# EAGLE design RFID (EAGLE 6.2)
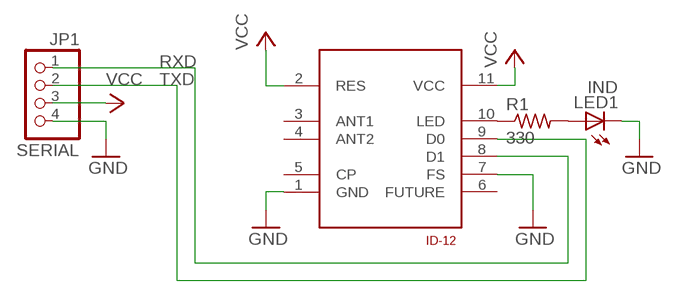
[diagram p0: schematic, sheet 1]

## Parts
JP1  SERIAL  PINHD-1X4  [1X04]
LED1  IND  LED3MM  [LED3MM]
R1  330  R-US_0207/10  [0207/10]
U$1  ID-20  [ID-20]

## Nets
GND: JP1.4 LED1.K(C) U$1.1(GND) U$1.7(FS)
N$1: R1.1 U$1.10(LED)
N$2: LED1.A R1.2
RXD: JP1.1 U$1.8(D1)
TXD: JP1.2 U$1.9(D0)
VCC: JP1.3 U$1.2(RES) U$1.11(VCC)
Unconnected: U$1.3(ANT1) U$1.4(ANT2) U$1.5(CP) U$1.6(FUTURE)

## Library data of the parts
JP1 = pinhead:PINHD-1X4: PIN HEADER
LED1 = led:LED: LED OSRAM: - CHIPLED LG R971, LG N971, LY N971, LG Q971, LY Q971, LO R971, LY R971 LH N974, LH R974 LS Q976, LO Q976, LY Q976 LO Q996 - Hyper CHIPLED LW Q18S LB Q993, LB Q99A, LB R99A - SideLED LS A670, LO A670, LY A670, LG A670, LP A670 LB A673, LV A673, LT A673, LW A673 LH A674 LY A675 LS A676, LA A676, LO A676, LY A676, LW A676 LS A679, LY A679, LG A679 - Hyper Micro SIDELED® LS Y876, LA Y876, LO Y876, LY Y876 LT Y87S - SmartLED LW L88C, LW L88S LB L89C, LB L89S, LG L890 LS L89K, LO L89K, LY L89K LS L896, LA L896, LO L896, LY L896 - TOPLED LS T670, LO T670, LY T670, LG T670, LP T670 LSG T670, LSP T670, LSY T670, LOP T670, LYG T670 LG T671, LOG T671, LSG T671 LB T673, LV T673, LT T673, LW T673 LH T674 LS T676, LA T676, LO T676, LY T676, LB T676, LH T676, LSB T676, LW T676 LB T67C, LV T67C, LT T67C, LS T67K, LO T67K, LY T67K, LW E67C LS E67B, LA E67B, LO E67B, LY E67B, LB E67C, LV E67C, LT E67C LW T67C LS T679, LY T679, LG T679 LS T770, LO T770, LY T770, LG T770, LP T770 LB T773, LV T773, LT T773, LW T773 LH T774 LS E675, LA E675, LY E675, LS T675 LS T776, LA T776, LO T776, LY T776, LB T776 LHGB T686 LT T68C, LB T68C - Hyper Mini TOPLED® LB M676 - Mini TOPLED Santana® LG M470 LS M47K, LO M47K, LY M47K Source: http://www.osram.convergy.de LUXEON: - LUMILED® LXK2-PW12-R00, LXK2-PW12-S00, LXK2-PW14-U00, LXK2-PW14-V00 LXK2-PM12-R00, LXK2-PM12-S00, LXK2-PM14-U00 LXK2-PE12-Q00, LXK2-PE12-R00, LXK2-PE12-S00, LXK2-PE14-T00, LXK2-PE14-U00 LXK2-PB12-K00, LXK2-PB12-L00, LXK2-PB12-M00, LXK2-PB14-N00, LXK2-PB14-P00, LXK2-PB14-Q00 LXK2-PR12-L00, LXK2-PR12-M00, LXK2-PR14-Q00, LXK2-PR14-R00 LXK2-PD12-Q00, LXK2-PD12-R00, LXK2-PD12-S00 LXK2-PH12-R00, LXK2-PH12-S00 LXK2-PL12-P00, LXK2-PL12-Q00, LXK2-PL12-R00 Source: www.luxeon.com KINGBRIGHT: KA-3528ASYC Source: www.kingbright.com
R1 = resistor:R-US_: RESISTOR, American symbol
U$1 = ID-12:ID-20

## Board
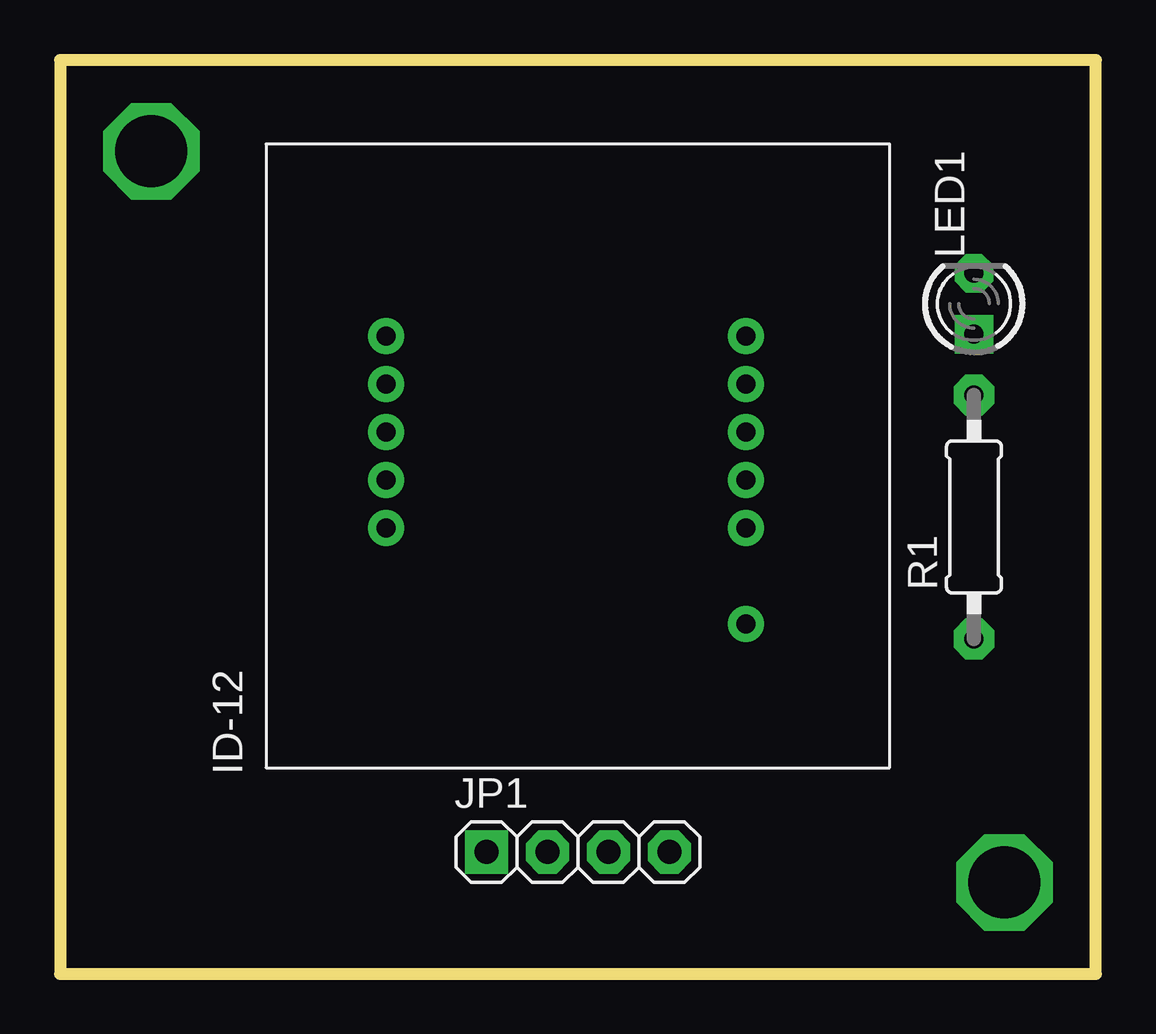
[diagram p1: board, top side]
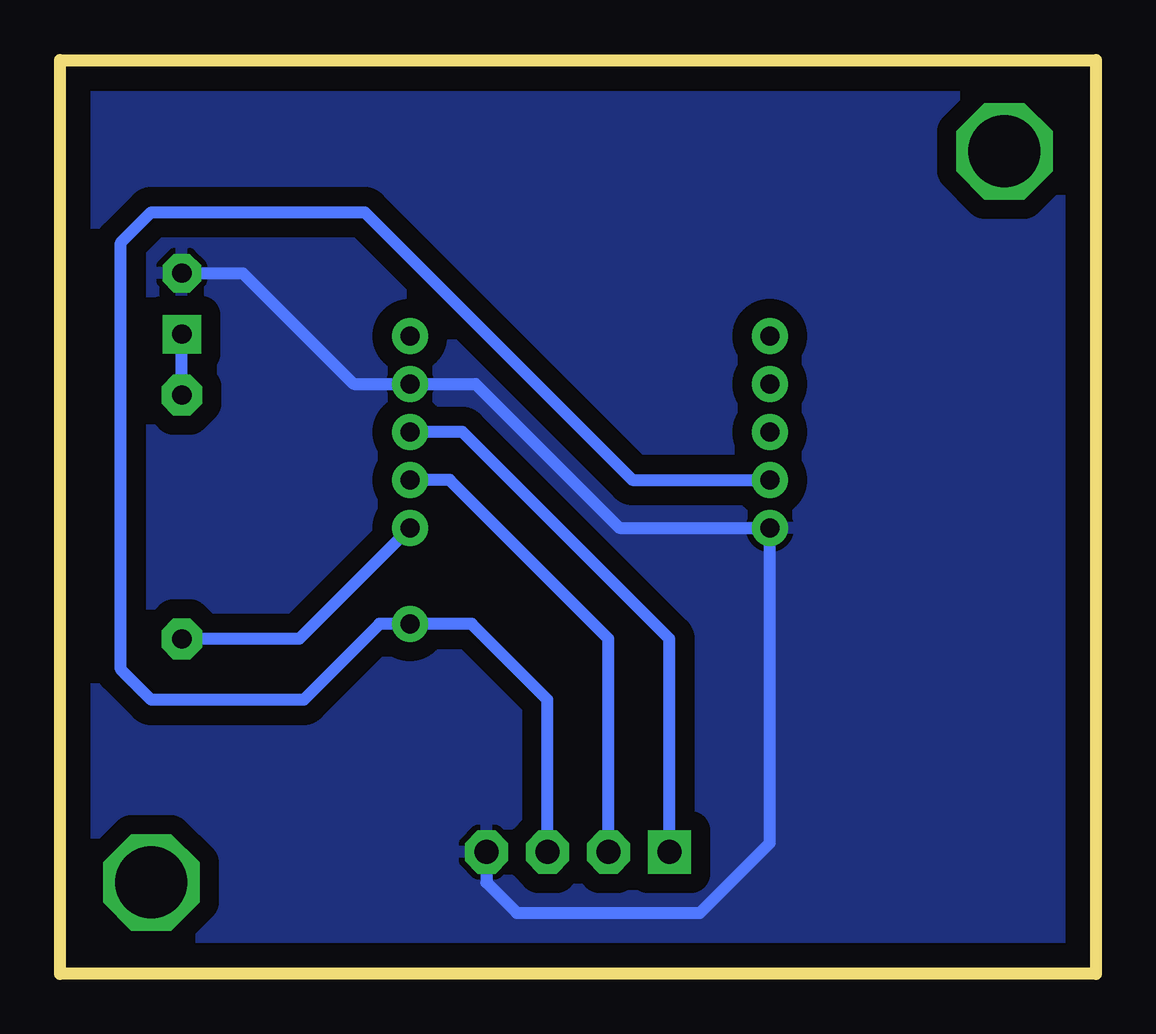
[diagram p2: board, bottom side, seen from below]

Size 43.18 x 38.1 mm. Coordinates in mm from the lower left corner, seen from the top.
Outline: 0,0 43.18,0 43.18,38.1 0,38.1 0,0
Copper layers (1*16): Top 0.035mm / dielectric 1.5mm / Bottom 0.035mm
Design rules: minimum track width 0.5mm, minimum drill 0.8mm, track to track 8mil, track to pad 8mil, pad to pad 8mil, via to via 8mil, smd to smd 8mil, copper to edge 40mil, drill to drill 8mil, minimum pad ring 10mil, minimum via ring 8mil, stop-mask expansion 4mil, vias tented up to drill 0mil, thermal gap 10mil

### Footprints (pad centres in the part's own frame; a part is rotated, then mirrored left to right if it is on the bottom)
1X04 = drill 1 pad 1.8 square: 1 -3.81,0 | drill 1 pad 1.8 octagon: 2 -1.27,0; 3 1.27,0; 4 3.81,0
LED3MM = drill 0.8 pad 1.6 square: A -1.27,0 | drill 0.8 pad 1.6 octagon: K 1.27,0
0207/10 = drill 0.8 pad 1.7 octagon: 1 -5.08,0; 2 5.08,0
ID-20 = drill 0.8 pad 1.5: 1 3,-8; 2 1,-8; 3 -1,-8; 4 -3,-8; 5 -5,-8; 6 -5,7; 7 -3,7; 8 -1,7; 9 1,7; 10 3,7; 11 7,7

### Placement (x,y rotation side)
JP1  21.59,5.08 0 top
LED1  38.1,27.94 90 top
R1  38.1,19.05 90 top
U$1  21.59,21.59 270 top

### Tracks (layer width: path | path; a pad name or v marks a point on that pad's centre or on a via)
GND
  Bottom 0.5: LED1.K 35.56,29.21 30.94,24.59 U$1.7 25.86,24.59 19.86,18.59 U$1.1 13.59,5.46 16.51,2.54 24.13,2.54 25.4,3.81 JP1.4
  pour Bottom (isolate 0.8): 0,0 43.18,0 43.18,38.1 0,38.1
N$1
  Bottom 0.5: U$1.10 33.21,13.97 R1.1
N$2
  Bottom 0.5: R1.2 LED1.A
N$3  (via drill 3)
  other vias: 3.81,34.29
N$4  (via drill 3)
  other vias: 39.37,3.81
RXD
  Bottom 0.5: JP1.1 17.78,13.97 26.4,22.59 U$1.8
TXD
  Bottom 0.5: JP1.2 20.32,13.97 26.94,20.59 U$1.9
VCC
  Bottom 0.5: JP1.3 22.86,11.43 26.02,14.59 U$1.11 29.86,14.59 33.02,11.43 39.37,11.43 40.64,12.7 40.64,30.48 39.37,31.75 30.48,31.75 19.32,20.59 U$1.2